# Altium schematic sheet USB_HS.SchDoc
size A3; SheetNumber: 5; SheetTotal: 13
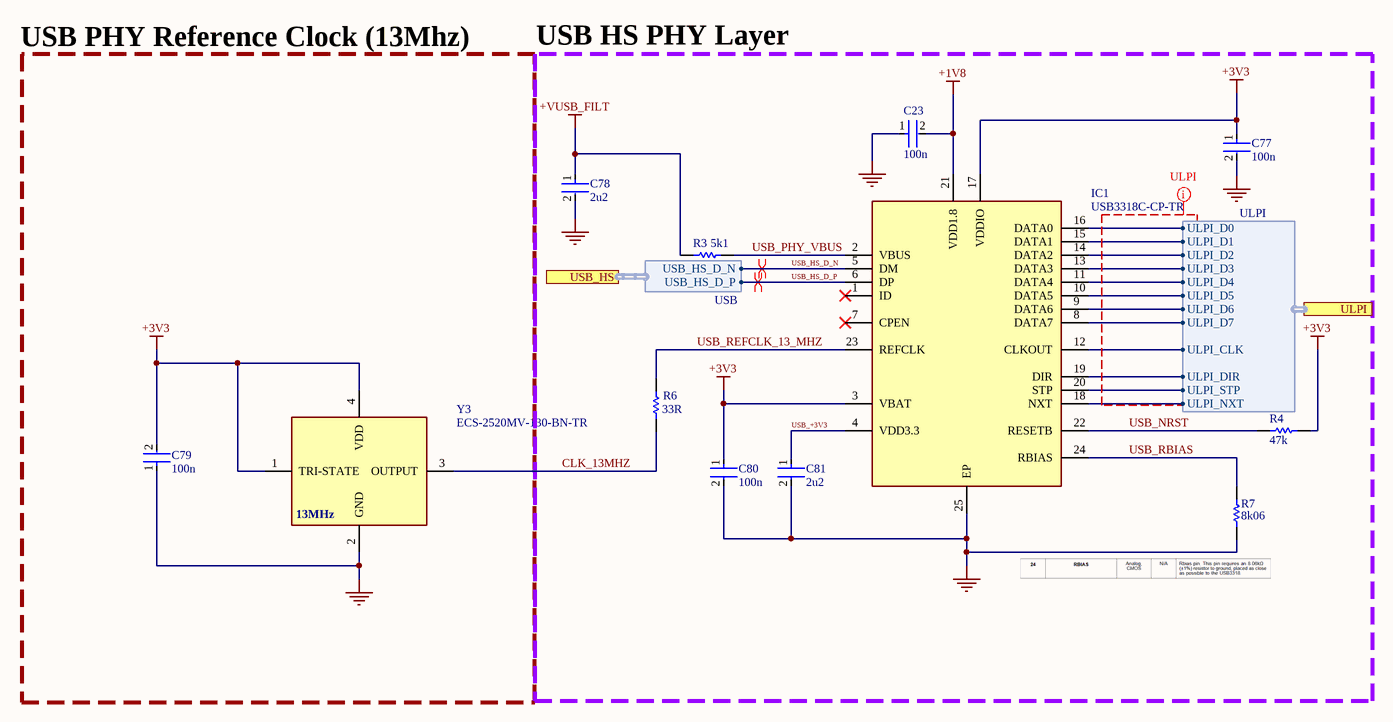
[diagram p0: USB_HS.SchDoc]

## Parts
C23  Capacitance: 100n  [FP-GCM155-0_05-IPC_A]  (hidden comment: GCM155R71H104ME02J)
C77  Capacitance: 100n  [FP-GCM155-0_05-IPC_A]  (hidden comment: GCM155R71H104ME02J)
C78  Capacitance: 2u2  [FP-GCH188-0_1-e0_2_0_5-MFG]  (hidden comment: GCM188C71A225KE02D)
C79  Capacitance: 100n  [FP-GCM155-0_05-IPC_A]  (hidden comment: GCM155R71H104ME02J)
C80  Capacitance: 100n  [FP-GCM155-0_05-IPC_A]  (hidden comment: GCM155R71H104ME02J)
C81  Capacitance: 2u2  [FP-GCH188-0_1-e0_2_0_5-MFG]  (hidden comment: GCM188C71A225KE02D)
IC1  USB3318C-CP-TR  [QFN50P400X400X100-25N-D]
R3  Resistance: 5k1  [RESC1005X40X25ML05T10]  (hidden comment: RC0402JR-075K1L)
R4  Resistance: 47k  [RESC1005X40X25LL05T10]  (hidden comment: RC0402JR-0747KL)
R6  Resistance: 33R  [RESC1005X40X25ML05T10]  (hidden comment: RC0402JR-1333RL)
R7  Resistance: 8k06  [RESC1005X40X25NL05T10]  (hidden comment: RC0402FR-07806KL)
Y3  ECS-2520MV-130-BN-TR  [ECS2520MV130BNTR]

## Blocks framed on the sheet
USB PHY Reference Clock (13Mhz): C79 Y3
USB HS PHY Layer: C23 C77 C78 C80 C81 IC1 R3 R4 R6 R7

## Ports
ULPI (harness ULPI, see high_level[5B], MCU_Connections[1B]), USB_HS (harness USB, see high_level[5B], Peripherals[4A])

## Harnesses
USB: USB_HS_D_N, USB_HS_D_P
ULPI: ULPI_D0, ULPI_D1, ULPI_D2, ULPI_D3, ULPI_D4, ULPI_D5, ULPI_D6, ULPI_D7, ULPI_CLK, ULPI_DIR, ULPI_STP, ULPI_NXT

## Nets
+1V8: C23.2 IC1.21(VDD1.8)
+3V3: C77.1 C79.2 C80.1 IC1.3(VBAT) IC1.17(VDDIO) R4.2 Y3.1(TRI-STATE) Y3.4(VDD)
+VUSB_FILT: C78.1 R3.1
GND: C23.1 C77.2 C78.2 C79.1 C80.2 C81.2 IC1.25(EP) R7.1 Y3.2(GND)
CLK_13MHZ: R6.2 Y3.3(OUTPUT)
USB_+3V3: C81.1 IC1.4(VDD3.3)
USB_HS_D_N: IC1.5(DM) ; port USB_HS.USB_HS_D_N
USB_HS_D_P: IC1.6(DP) ; port USB_HS.USB_HS_D_P
USB_NRST: IC1.22(RESETB) R4.1
USB_PHY_VBUS: IC1.2(VBUS) R3.2
USB_RBIAS: IC1.24(RBIAS) R7.2
USB_REFCLK_13_MHZ: IC1.23(REFCLK) R6.1
NetIC1_8: IC1.8(DATA7) ; port ULPI.ULPI_D7
NetIC1_9: IC1.9(DATA6) ; port ULPI.ULPI_D6
NetIC1_10: IC1.10(DATA5) ; port ULPI.ULPI_D5
NetIC1_11: IC1.11(DATA4) ; port ULPI.ULPI_D4
NetIC1_12: IC1.12(CLKOUT) ; port ULPI.ULPI_CLK
NetIC1_13: IC1.13(DATA3) ; port ULPI.ULPI_D3
NetIC1_14: IC1.14(DATA2) ; port ULPI.ULPI_D2
NetIC1_15: IC1.15(DATA1) ; port ULPI.ULPI_D1
NetIC1_16: IC1.16(DATA0) ; port ULPI.ULPI_D0
NetIC1_18: IC1.18(NXT) ; port ULPI.ULPI_NXT
NetIC1_19: IC1.19(DIR) ; port ULPI.ULPI_DIR
NetIC1_20: IC1.20(STP) ; port ULPI.ULPI_STP

Not connected (* = marked no-connect by the designer): IC1 1(ID)* 7(CPEN)*

## Layout directives
mark named ULPI: (no net found under the mark)
differential pair: USB_HS_D_N, USB_HS_D_P

## Notes on the sheet
- (near Y3) 13MHz

## Library data of the parts
C23 C77 C79 C80 = CMP-06035-028957-1: Ceramic Capacitor for Automotive 100nF ±20% 50VDC X7R 0402 Paper T/R
C78 C81 = CMP-00260-57357036-1: GCM188C71A225KE02D Multilayer Ceramic Capacitor, 2.2 uF, 10 V, ± 10%, X7S, 0603 [1608 Metric]; NexarPartId: 57357036; RoHS: Non-Compliant; Lifecycle Status: Production
IC1 = USB3318C-CP-TR: Integrated Circuit; Manufacturer_Name: Microchip; Datasheet Link: http://www.microchip.com/mymicrochip/filehandler.aspx?ddocname=en562029; Height: 1mm; Manufacturer_Part_Number: USB3318C-CP-TR; Mouser Part Number: 886-USB3318C-CP-TR; Mouser Price/Stock: https://www.mouser.co.uk/ProductDetail/Microchip-Technology/USB3318C-CP-TR?qs=pA5MXup5wxEqKRd0j%252Bo%252BXA%3D%3D; Arrow Part Number: USB3318C-CP-TR; Arrow Price/Stock: null?region=nac
R3 = CMP-2002-08025-1: Manufacturer: Yageo / Phycomp; Part Number: RC0402JR-075K1L
R4 = CMP-1011-00114-2: Manufacturer: Yageo / Phycomp; Part Number: RC0402JR-0747KL
R6 = CMP-2002-08082-1: Manufacturer: Yageo; Part Number: RC0402JR-1333RL
R7 = CMP-1011-00838-2: Manufacturer: Yageo / Phycomp; Part Number: RC0402FR-07806KL
Y3 = ECS-2520MV-130-BN-TR: Crystal or Oscillator; Manufacturer_Name: ECS; Datasheet Link: https://ecsxtal.com/store/pdf/ECS-2520MV.pdf; Height: 0.9mm; Manufacturer_Part_Number: ECS-2520MV-130-BN-TR; Mouser Part Number: 520-S2520MV130BNTR; Mouser Price/Stock: https://www.mouser.co.uk/ProductDetail/ECS/ECS-2520MV-130-BN-TR?qs=zW32dvEIR3txl7djIFQDkw%3D%3D; Arrow Part Number: ECS-2520MV-130-BN-TR; Arrow Price/Stock: https://www.arrow.com/en/products/ecs-2520mv-130-bn-tr/ecs-international?utm_currency=USD&region=nac